# EAGLE schematic piezo_amp (EAGLE 7.5.0)
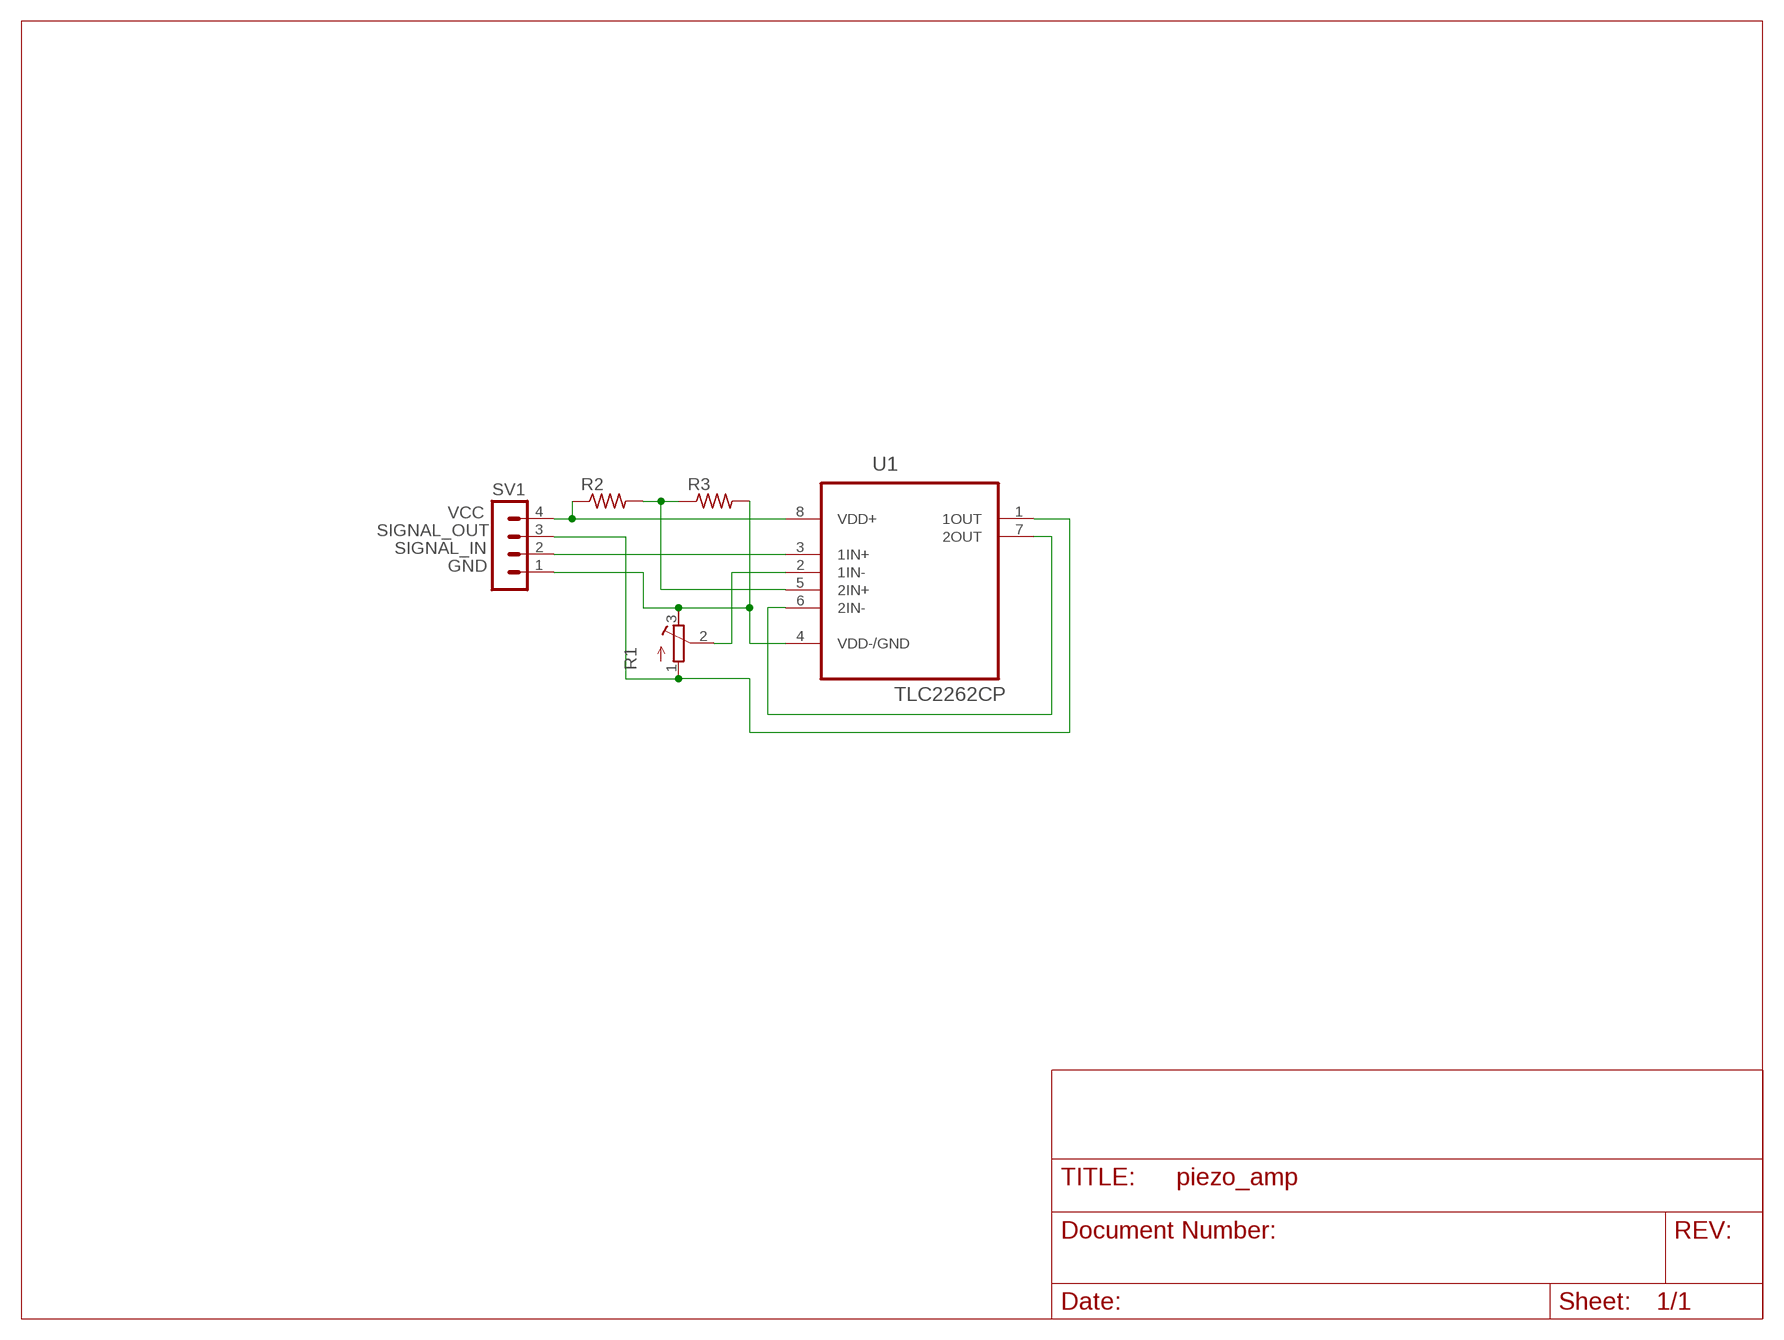
[diagram p0: schematic, sheet 1]

## Parts
R1  R-TRIMM3296W  [RTRIM3296W]
R2  R-US_0204/5  [0204/5]
R3  R-US_0204/5  [0204/5]
SV1  MA04-1  [MA04-1]
U1  TLC2262CP  [DIP254P762X508-8]

## Nets
GND: R1.3(E) R3.2 SV1.1 U1.4(VDD-/GND)
N$1: U1.6(2IN-) U1.7(2OUT)
N$2: R2.2 R3.1 U1.5(2IN+)
N$5: R1.2(S) U1.2(1IN-)
SIGNAL_IN: SV1.2 U1.3(1IN+)
SIGNAL_OUT: R1.1(A) SV1.3 U1.1(1OUT)
VCC: R2.1 SV1.4 U1.8(VDD+)

## Library data of the parts
R1 = resistor:R-TRIMM: Trimm resistor
R2 R3 = rcl:R-US_: RESISTOR, American symbol
SV1 = con-lstb:MA04-1: PIN HEADER; OC_FARNELL: unknown; OC_NEWARK: unknown
U1 = Texas Instruments_By_element14_Batch_1:TLC2262CP: OPERATIONAL AMPLIFIER; MPN: TLC2262CP; OC_FARNELL: 8453799; OC_NEWARK: 35K1181; PACKAGE: PDIP; SUPPLIER: Texas Instruments